# Altium schematic sheet 04.RK3399 DDR Controller.SchDoc
size A4; SheetNumber: 4; SheetTotal: 10
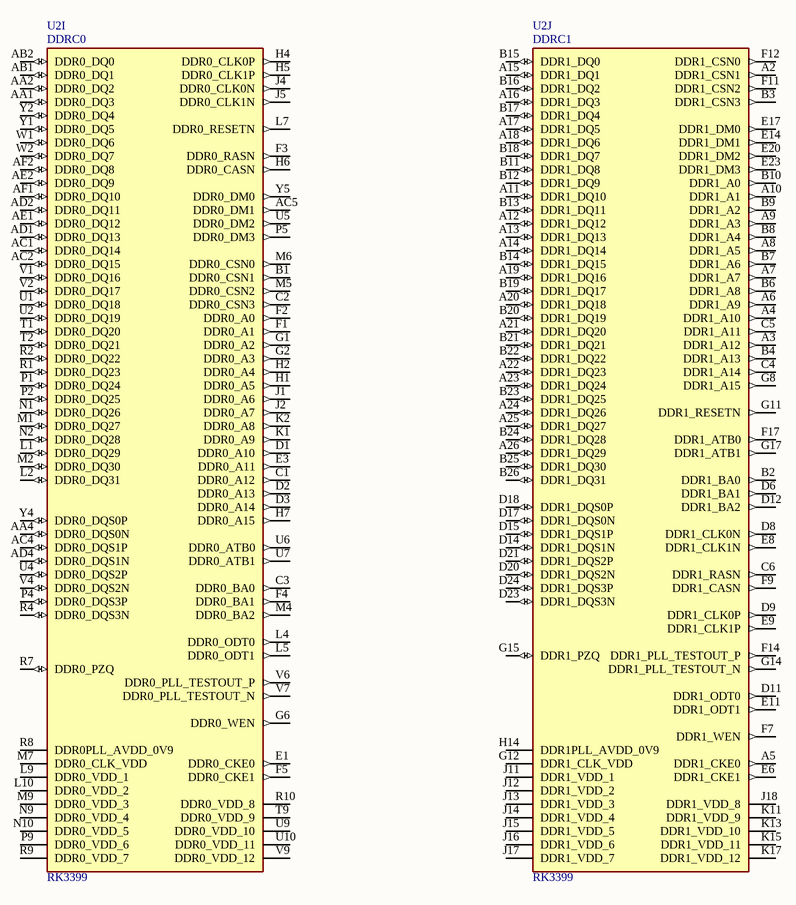
[diagram p0: 04.RK3399 DDR Controller.SchDoc]

## Parts
U2  RK3399  [BGA828C65P31X31_2100X2100X161N]  (parts I,J of 32)

## Nets

Not connected (* = marked no-connect by the designer): U2 A2(DDR1_CSN1) A3(DDR1_A12) A4(DDR1_A10) A5(DDR1_CKE0) A6(DDR1_A9) A7(DDR1_A7) A8(DDR1_A5) A9(DDR1_A3) A10(DDR1_A1) A11(DDR1_DQ10) A12(DDR1_DQ12) A13(DDR1_DQ13) A14(DDR1_DQ14) A15(DDR1_DQ1) A16(DDR1_DQ3) A17(DDR1_DQ5) A18(DDR1_DQ6) A19(DDR1_DQ16) A20(DDR1_DQ18) A21(DDR1_DQ20) A22(DDR1_DQ23) A23(DDR1_DQ24) A24(DDR1_DQ26) A25(DDR1_DQ27) A26(DDR1_DQ29) AA1(DDR0_DQ3) AA2(DDR0_DQ2) AA4(DDR0_DQS0N) AB1(DDR0_DQ1) AB2(DDR0_DQ0) AC1(DDR0_DQ14) AC2(DDR0_DQ15) AC4(DDR0_DQS1P) AC5(DDR0_DM1) AD1(DDR0_DQ13) AD2(DDR0_DQ11) AD4(DDR0_DQS1N) AE1(DDR0_DQ12) AE2(DDR0_DQ9) AF1(DDR0_DQ10) AF2(DDR0_DQ8) B1(DDR0_CSN1) B2(DDR1_BA0) B3(DDR1_CSN3) B4(DDR1_A13) B6(DDR1_A8) B7(DDR1_A6) B8(DDR1_A4) B9(DDR1_A2) B10(DDR1_A0) B11(DDR1_DQ8) B12(DDR1_DQ9) B13(DDR1_DQ11) B14(DDR1_DQ15) B15(DDR1_DQ0) B16(DDR1_DQ2) B17(DDR1_DQ4) B18(DDR1_DQ7) B19(DDR1_DQ17) B20(DDR1_DQ19) B21(DDR1_DQ21) B22(DDR1_DQ22) B23(DDR1_DQ25) B24(DDR1_DQ28) B25(DDR1_DQ30) B26(DDR1_DQ31) C1(DDR0_A12) C2(DDR0_CSN3) C3(DDR0_BA0) C4(DDR1_A14) C5(DDR1_A11) C6(DDR1_RASN) D1(DDR0_A10) D2(DDR0_A13) D3(DDR0_A14) D6(DDR1_BA1) D8(DDR1_CLK0N) D9(DDR1_CLK0P) D11(DDR1_ODT0) D12(DDR1_BA2) D14(DDR1_DQS1N) D15(DDR1_DQS1P) D17(DDR1_DQS0N) D18(DDR1_DQS0P) D20(DDR1_DQS2N) D21(DDR1_DQS2P) D23(DDR1_DQS3N) D24(DDR1_DQS3P) E1(DDR0_CKE0) E3(DDR0_A11) E6(DDR1_CKE1) E8(DDR1_CLK1N) E9(DDR1_CLK1P) E11(DDR1_ODT1) E14(DDR1_DM1) E17(DDR1_DM0) E20(DDR1_DM2) E23(DDR1_DM3) F1(DDR0_A1) F2(DDR0_A0) F3(DDR0_RASN) F4(DDR0_BA1) F5(DDR0_CKE1) F7(DDR1_WEN) F9(DDR1_CASN) F11(DDR1_CSN2) F12(DDR1_CSN0) F14(DDR1_PLL_TESTOUT_P) F17(DDR1_ATB0) G1(DDR0_A2) G2(DDR0_A3) G6(DDR0_WEN) G8(DDR1_A15) G11(DDR1_RESETN) G12(DDR1_CLK_VDD) G14(DDR1_PLL_TESTOUT_N) G15(DDR1_PZQ) G17(DDR1_ATB1) H1(DDR0_A5) H2(DDR0_A4) H4(DDR0_CLK0P) H5(DDR0_CLK1P) H6(DDR0_CASN) H7(DDR0_A15) H14(DDR1PLL_AVDD_0V9) J1(DDR0_A6) J2(DDR0_A7) J4(DDR0_CLK0N) J5(DDR0_CLK1N) J11(DDR1_VDD_1) J12(DDR1_VDD_2) J13(DDR1_VDD_3) J14(DDR1_VDD_4) J15(DDR1_VDD_5) J16(DDR1_VDD_6) J17(DDR1_VDD_7) J18(DDR1_VDD_8) K1(DDR0_A9) K2(DDR0_A8) K11(DDR1_VDD_9) K13(DDR1_VDD_10) K15(DDR1_VDD_11) K17(DDR1_VDD_12) L1(DDR0_DQ29) L2(DDR0_DQ31) L4(DDR0_ODT0) L5(DDR0_ODT1) L7(DDR0_RESETN) L9(DDR0_VDD_1) L10(DDR0_VDD_2) M1(DDR0_DQ27) M2(DDR0_DQ30) M4(DDR0_BA2) M5(DDR0_CSN2) M6(DDR0_CSN0) M7(DDR0_CLK_VDD) M9(DDR0_VDD_3) N1(DDR0_DQ26) N2(DDR0_DQ28) N9(DDR0_VDD_4) N10(DDR0_VDD_5) P1(DDR0_DQ24) P2(DDR0_DQ25) P4(DDR0_DQS3P) P5(DDR0_DM3) P9(DDR0_VDD_6) R1(DDR0_DQ23) R2(DDR0_DQ22) R4(DDR0_DQS3N) R7(DDR0_PZQ) R8(DDR0PLL_AVDD_0V9) R9(DDR0_VDD_7) R10(DDR0_VDD_8) T1(DDR0_DQ20) T2(DDR0_DQ21) T9(DDR0_VDD_9) U1(DDR0_DQ18) U2(DDR0_DQ19) U4(DDR0_DQS2P) U5(DDR0_DM2) U6(DDR0_ATB0) U7(DDR0_ATB1) U9(DDR0_VDD_10) U10(DDR0_VDD_11) V1(DDR0_DQ16) V2(DDR0_DQ17) V4(DDR0_DQS2N) V6(DDR0_PLL_TESTOUT_P) V7(DDR0_PLL_TESTOUT_N) V9(DDR0_VDD_12) W1(DDR0_DQ6) W2(DDR0_DQ7) Y1(DDR0_DQ5) Y2(DDR0_DQ4) Y4(DDR0_DQS0P) Y5(DDR0_DM0)

## Notes on the sheet
- (in symbol RK3399, part I) DDRC0
- (in symbol RK3399, part J) DDRC1

## Library data of the parts
U2 = RK3399: RK3399 ROCK Pi 4 Model A 2GB - ARMÂ® CortexÂ®-A53, CortexÂ®-A72 MPU Embedded Evaluation Board; MF: Rockchip; SnapEDA_Link: https://www.snapeda.com/parts/RK3399/Fuzhou+Rockchip+Electronics+Co/view-part/?ref=snap; Package: Seeed Technology; MP: RK3399; Check_prices: https://www.snapeda.com/parts/RK3399/Fuzhou+Rockchip+Electronics+Co/view-part/?ref=eda; Price: None; Value: *; Availability: Not in stock